# EAGLE board firefly-ice (EAGLE 6.4)
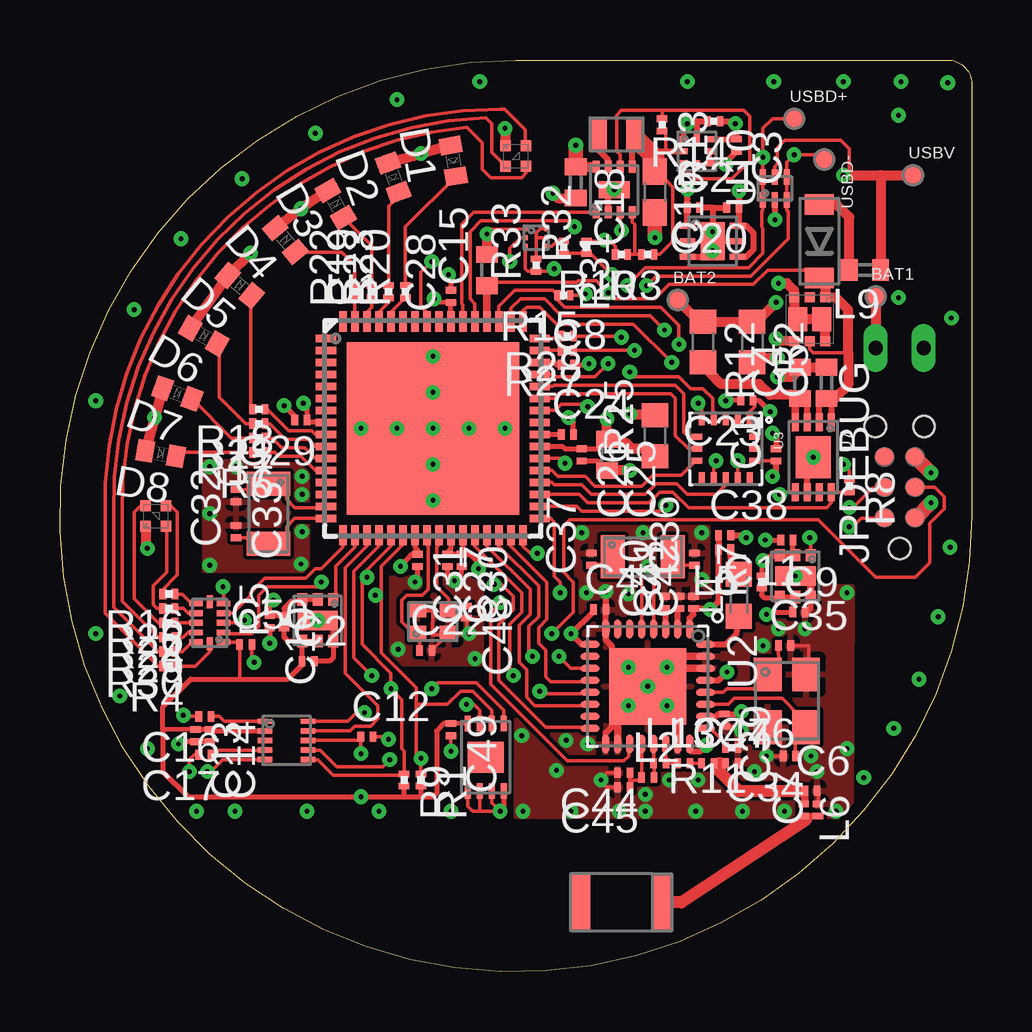
[diagram p6: board, top side]
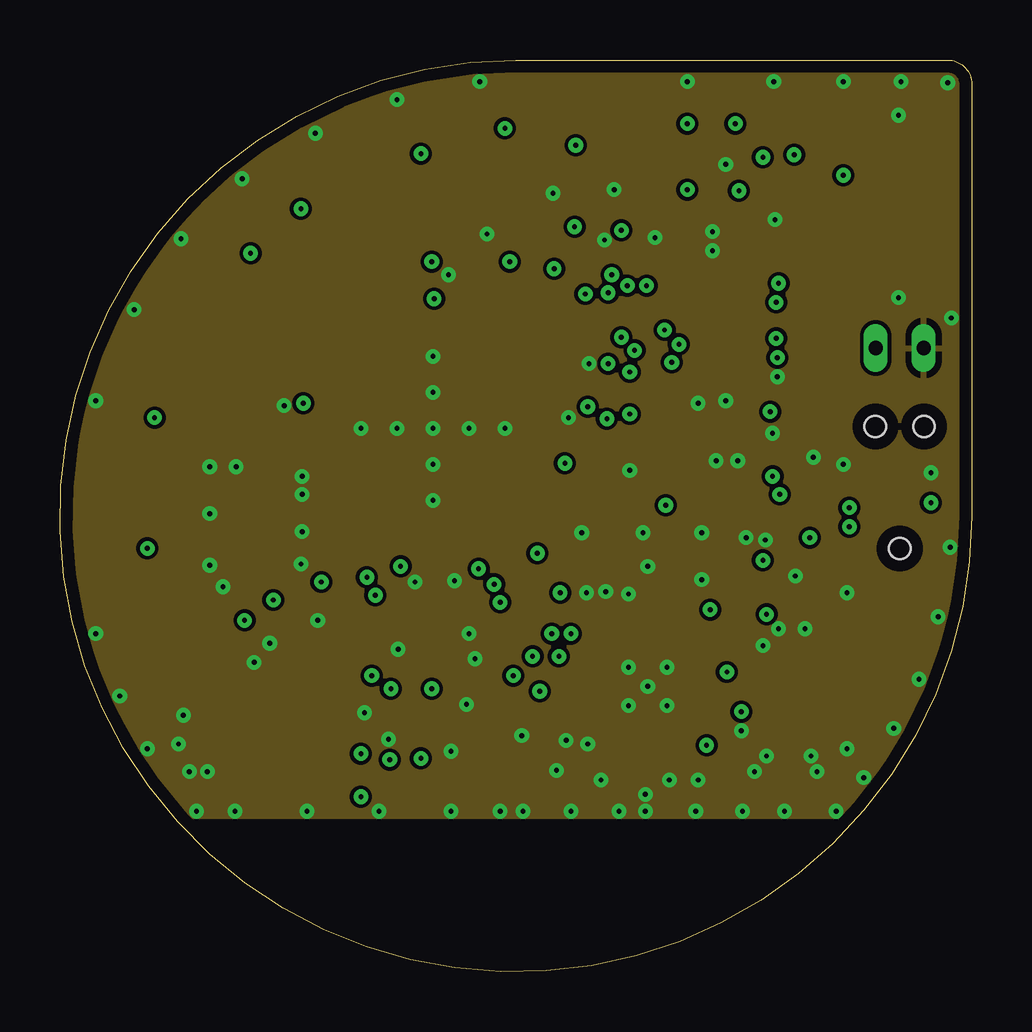
[diagram p7: board, inner layer Route2]
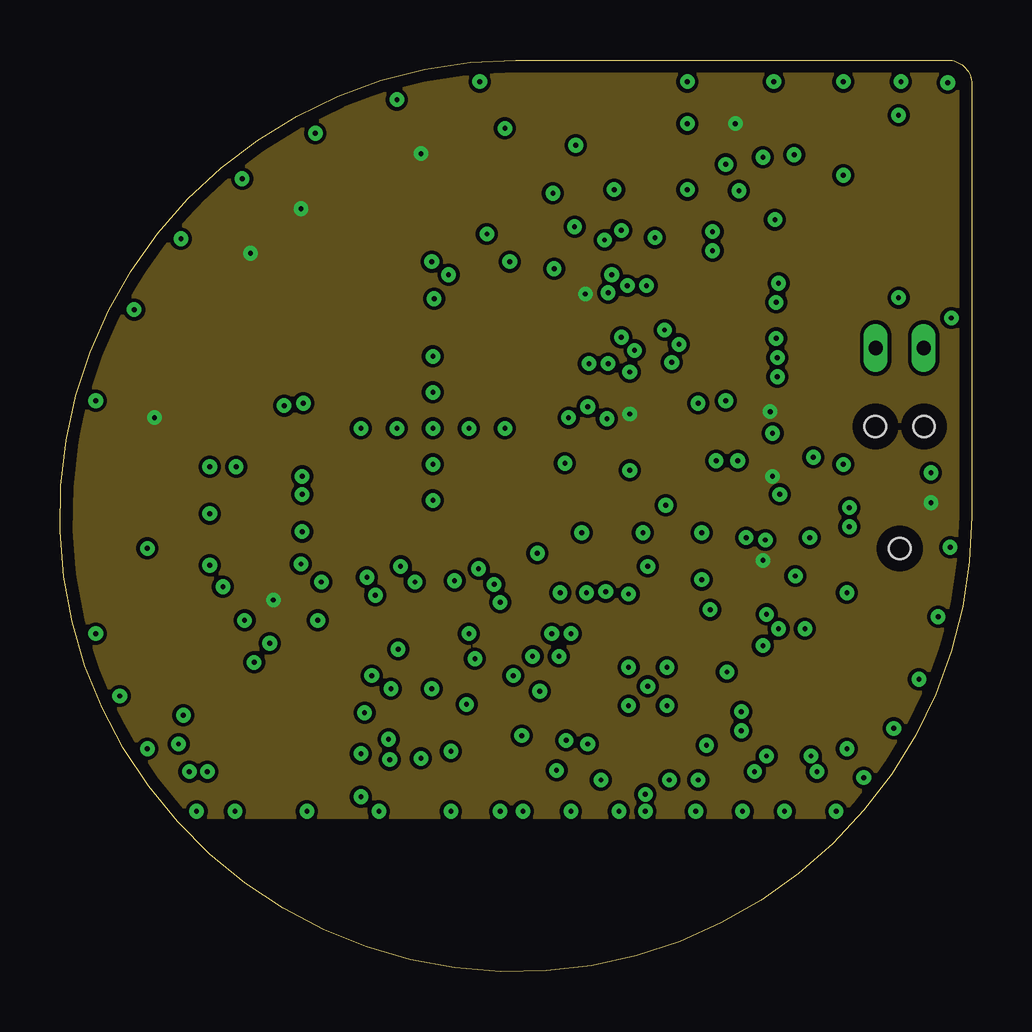
[diagram p8: board, inner layer Route15]
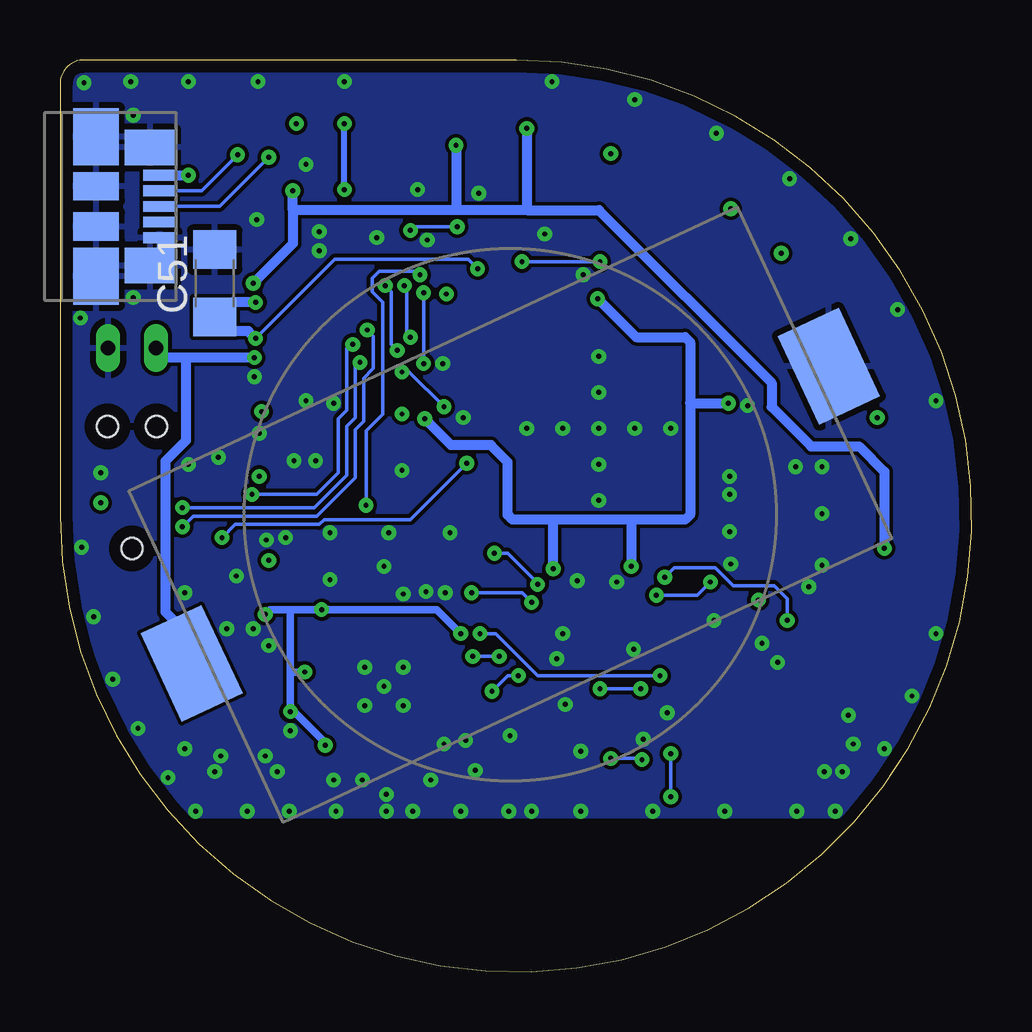
[diagram p9: board, bottom side, seen from below]

Size 37.99 x 37.99 mm. Coordinates in mm from the lower left corner, seen from the top.
Outline: 37.99,18.99 arc-270 18.99,37.99 36.99,37.99 arc-90 37.99,36.99 37.99,18.99
Copper layers (1+2*15+16): Top 0.0178mm / dielectric 12mil / Route2 0.0356mm / dielectric 28mil / Route15 0.0356mm / dielectric 12mil / Bottom 0.0178mm
Design rules "SSC-EAGLE-4Lyr_v1.0.0.3": minimum track width 6mil, minimum drill 8mil, track to track 6mil, track to pad 6mil, pad to pad 6mil, via to via 6mil, smd to smd 6mil, copper to edge 20mil, drill to drill 16mil, minimum pad ring 8mil, minimum via ring 8mil, stop-mask expansion 3mil, vias tented up to drill 0mil, thermal gap 10mil

## Footprints (pad centres in the part's own frame; a part is rotated, then mirrored left to right if it is on the bottom)
FR05_S1_N_0_110 = smd 0.8 x 2.4: FP -1.7,0; MP 1.7,0
SMTU2450N = smd 2.79 x 4.06: + -14.65,0; - 14.65,0
WP-28AWG = drill 0.6 long: 1 0,0
TARGET-PIN-1MM = smd 0.84 x 0.84: 1 0,0
C0201 = smd 0.28 x 0.43: 1 -0.255,0; 2 0.255,0
C0402 = smd 0.7 x 0.9: 1 -0.65,0; 2 0.65,0
C0603 = smd 1.1 x 1: 1 -0.85,0; 2 0.85,0
C1206 = smd 1.6 x 1.8: 1 -1.4,0; 2 1.4,0
SMLP34 = smd 0.45 x 0.45: 1 -0.425,0.425; 2 0.425,0.425; 3 0.425,-0.425; 4 -0.425,-0.425
D0402 = smd 0.7 x 0.9: A 0.65,0; C -0.65,0
SOD-123F = smd 0.85 x 1.2: A 1.525,0; C -1.525,0
MOLEX-47346 = smd 0.45 x 1.38: 1 -1.3,-0.69; 2 -0.65,-0.69; 3 0,-0.69; 4 0.65,-0.69; 5 1.3,-0.69 | smd 1.475 x 2.1: G1 -2.462,-1.1; G6 2.462,-1.1 | smd 2.375 x 1.9: G2 -2.913,-3.35; G5 2.913,-3.35 | smd 1.175 x 1.9: G3 -0.838,-3.35; G4 0.838,-3.35
TC2030-MCP-NL = smd 0.787 x 0.787: 1 1.27,-0.635; 2 1.27,0.635; 3 2.54,-0.635; 4 2.54,0.635 | smd 0.72 x 0.72: 5 3.81,-0.635; 6 3.81,0.635 | hole 0.889: 0,0; 5.08,-1.016; 5.08,1.016
L0201 = smd 0.28 x 0.43: 1 -0.255,0; 2 0.255,0
0603 = smd 1.05 x 1.08: 1 -0.875,0; 2 0.875,0
L0805 = smd 0.7 x 1.45: 1 -0.75,0; 2 0.75,0
L0402 = smd 0.7 x 0.9: 1 -0.65,0; 2 0.65,0
R0201 = smd 0.28 x 0.43: 1 -0.255,0; 2 0.255,0
R0603@1 = smd 1 x 1.1: 1 -0.85,0; 2 0.85,0
QFN64 = smd 0.85 x 0.3: 1 -4.45,3.75; 2 -4.45,3.25; 3 -4.45,2.75; 4 -4.45,2.25; 5 -4.45,1.75; 6 -4.45,1.25; 7 -4.45,0.75; 8 -4.45,0.25; 9 -4.45,-0.25; 10 -4.45,-0.75; 11 -4.45,-1.25; 12 -4.45,-1.75; 13 -4.45,-2.25; 14 -4.45,-2.75; 15 -4.45,-3.25; 16 -4.45,-3.75; 33 4.45,-3.75; 34 4.45,-3.25; 35 4.45,-2.75; 36 4.45,-2.25; 37 4.45,-1.75; 38 4.45,-1.25; 39 4.45,-0.75; 40 4.45,-0.25; 41 4.45,0.25; 42 4.45,0.75; 43 4.45,1.25; 44 4.45,1.75; 45 4.45,2.25; 46 4.45,2.75; 47 4.45,3.25; 48 4.45,3.75 | smd 0.3 x 0.85: 17 -3.75,-4.45; 18 -3.25,-4.45; 19 -2.75,-4.45; 20 -2.25,-4.45; 21 -1.75,-4.45; 22 -1.25,-4.45; 23 -0.75,-4.45; 24 -0.25,-4.45; 25 0.25,-4.45; 26 0.75,-4.45; 27 1.25,-4.45; 28 1.75,-4.45; 29 2.25,-4.45; 30 2.75,-4.45; 31 3.25,-4.45; 32 3.75,-4.45; 49 3.75,4.45; 50 3.25,4.45; 51 2.75,4.45; 52 2.25,4.45; 53 1.75,4.45; 54 1.25,4.45; 55 0.75,4.45; 56 0.25,4.45; 57 -0.25,4.45; 58 -0.75,4.45; 59 -1.25,4.45; 60 -1.75,4.45; 61 -2.25,4.45; 62 -2.75,4.45; 63 -3.25,4.45; 64 -3.75,4.45 | smd 7.2 x 7.2: 65 0,0
QFN-32 = smd 0.8 x 0.3: 1 -2.4,1.75; 2 -2.4,1.25; 3 -2.4,0.75; 4 -2.4,0.25; 5 -2.4,-0.25; 6 -2.4,-0.75; 7 -2.4,-1.25; 8 -2.4,-1.75; 17 2.4,-1.75; 18 2.4,-1.25; 19 2.4,-0.75; 20 2.4,-0.25; 21 2.4,0.25; 22 2.4,0.75; 23 2.4,1.25; 24 2.4,1.75 | smd 0.3 x 0.8: 9 -1.75,-2.4; 10 -1.25,-2.4; 11 -0.75,-2.4; 12 -0.25,-2.4; 13 0.25,-2.4; 14 0.75,-2.4; 15 1.25,-2.4; 16 1.75,-2.4; 25 1.75,2.4; 26 1.25,2.4; 27 0.75,2.4; 28 0.25,2.4; 29 -0.25,2.4; 30 -0.75,2.4; 31 -1.25,2.4; 32 -1.75,2.4 | smd 3.2 x 3.2: 33 0,0
LGA16_3X3 = smd 0.45 x 0.25: 1 -1.2,1; 2 -1.2,0.5; 3 -1.2,0; 4 -1.2,-0.5; 5 -1.2,-1; 9 1.2,-1; 10 1.2,-0.5; 11 1.2,0; 12 1.2,0.5; 13 1.2,1 | smd 0.25 x 0.45: 6 -0.5,-1.2; 7 0,-1.2; 8 0.5,-1.2; 14 0.5,1.2; 15 0,1.2; 16 -0.5,1.2
DFN10-2X2 = smd 0.6 x 0.225: 1 -0.9,0.8; 2 -0.9,0.4; 3 -0.9,0; 4 -0.9,-0.4; 5 -0.9,-0.8; 6 0.9,-0.8; 7 0.9,-0.4; 8 0.9,0; 9 0.9,0.4; 10 0.9,0.8
R-PX2QFN-N12 = smd 0.55 x 0.24: 1 -0.575,0.8; 2 -0.575,0.4; 3 -0.575,0; 4 -0.575,-0.4; 5 -0.575,-0.8; 7 0.575,-0.8; 8 0.575,-0.4; 9 0.575,0; 10 0.575,0.4; 11 0.575,0.8 | smd 0.25 x 0.55: 6 0,-0.875; 12 0,0.875
SOT963 = smd 0.2 x 0.2: 1 -0.45,0.36; 2 -0.45,0; 3 -0.45,-0.36; 4 0.45,-0.36; 5 0.45,0; 6 0.45,0.36
DFN8 = smd 0.75 x 0.3: 1 -1.45,0.75; 2 -1.45,0.25; 3 -1.45,-0.25; 4 -1.45,-0.75; 5 1.45,-0.75; 6 1.45,-0.25; 7 1.45,0.25; 8 1.45,0.75 | smd 1.75 x 1.45: PGND 0,0
MICROFET-2X2-6L = smd 0.52 x 0.42: 1 -0.865,0.65; 2 -0.865,0; 3 -0.865,-0.65; 4 0.865,-0.65; 5 0.865,0; 6 0.865,0.65 | smd 0.8 x 1.68: 7 0,0
UQFN6 = smd 0.65 x 0.25: 1 -0.475,0.5; 2 -0.475,0; 3 -0.475,-0.5; 4 0.475,-0.5; 5 0.475,0; 6 0.475,0.5
S-PWSON-N6 = smd 0.65 x 0.25: 1 -1.05,0.65; 2 -1.05,0; 3 -1.05,-0.65; 4 1.05,-0.65; 5 1.05,0; 6 1.05,0.65 | smd 1 x 1.6: TP 0,0
S-PWSON-N8 = smd 0.5 x 0.28: 1 -0.95,0.75; 2 -0.95,0.25; 3 -0.95,-0.25; 4 -0.95,-0.75; 5 0.95,-0.75; 6 0.95,-0.25; 7 0.95,0.25; 8 0.95,0.75 | smd 0.7 x 1.3: TP 0,0
SOT902-2 = smd 0.35 x 0.25: 1 -0.55,0.5; 2 -0.55,0; 3 -0.55,-0.5; 5 0.55,-0.5; 6 0.55,0; 7 0.55,0.5 | smd 0.25 x 0.35: 4 0,-0.55; 8 0,0.55
MO-229 = smd 0.42 x 0.42: 1 -0.915,0.65; 2 -0.915,0; 3 -0.915,-0.65; 4 0.915,-0.65; 5 0.915,0; 6 0.915,0.65 | smd 1 x 0.8: C 0,0.5; D 0,-0.5
UDFN-8 = smd 0.65 x 0.25: 1 -1.4,0.75; 2 -1.4,0.25; 3 -1.4,-0.25; 4 -1.4,-0.75; 5 1.4,-0.75; 6 1.4,-0.25; 7 1.4,0.25; 8 1.4,0.75 | smd 1.3 x 1.5: TP 0,0
9HT10 = smd 1 x 1.8: 1 -1.25,0; 2 1.25,0
TSX-3225 = smd 1.15 x 1.4: 1 -0.8,1.1; 2 -0.8,-1.1; 3 0.8,-1.1; 4 0.8,1.1
ABM11 = smd 0.65 x 0.75: 1 -0.5,0.65; 2 -0.5,-0.65; 3 0.5,-0.65; 4 0.5,0.65

## Placement (x,y rotation side)
A1  FR05_S1_N_0_110  [FR05_S1_N_0_110]  23.39,2.89 180 top
B1  BATTERYSMTU2450N  [SMTU2450N]  19.23,19.04 25 bottom
B+  TARGET-PINWP-28AWG  [WP-28AWG]  33.99,25.99 0 top
B-  TARGET-PINWP-28AWG  [WP-28AWG]  35.99,25.99 0 top
BAT1  TARGET-PIN  [TARGET-PIN-1MM]  33.99,28.14 0 top
BAT2  TARGET-PIN  [TARGET-PIN-1MM]  25.74,27.99 0 top
C1  100nF  [C0201]  29.84,21.54 90 top
C2  100nF  [C0201]  10.34,12.94 0 top
C3  1uF  [C0201]  28.19,34.44 270 top
C4  4.7uF  [C0402]  30.84,24.54 90 top
C5  4.7uF  [C0402]  31.94,24.54 90 top
C6  1.2pF  [C0201]  31.29,7.54 0 top
C7  DNS  [C0201]  31.59,6.74 90 top
C8  1uF  [C0201]  21.14,25.29 0 top
C9  100nF  [C0201]  30.79,14.99 0 top
C10  1uF  [C0201]  8.74,14.59 270 top
C11  1uF  [C0201]  30.29,17.99 180 top
C12  100nF  [C0201]  12.79,9.79 0 top
C13  100nF  [C0201]  5.64,9.84 270 top
C14  1uF  [C0201]  6.24,9.84 270 top
C15  4.7uF  [C0402]  17.79,29.24 90 top
C16  100nF  [C0201]  6.04,10.64 180 top
C17  100nF  [C0201]  6.04,9.04 180 top
C18  10uF  [C0402]  21.49,32.89 270 top
C19  22uF  [C0603]  24.79,32.49 270 top
C20  1uF  [C0201]  28.04,31.84 180 top
C21  1uF  [C0201]  26.39,31.84 0 top
C22  12pF  [C0201]  15.24,13.39 0 top
C23  100nF  [C0201]  28.62,23.81 180 top
C24  1uF  [C0201]  21.14,22.39 0 top
C25  10uF  [C0402]  22.79,21.54 270 top
C26  100nF  [C0201]  21.74,21.54 270 top
C27  100nF  [C0201]  16.14,17.14 270 top
C28  100nF  [C0201]  16.29,28.14 90 top
C29  100nF  [C0201]  10.04,22.99 180 top
C30  100nF  [C0201]  16.74,17.14 270 top
C31  100nF  [C0201]  14.89,17.14 270 top
C32  12pF  [C0201]  7.34,18.34 90 top
C33  12pF  [C0201]  7.34,19.84 270 top
C34  12pF  [C0201]  30.39,8.99 180 top
C35  12pF  [C0201]  30.19,13.59 0 top
C36  15pF  [C0201]  26.44,17.19 90 top
C37  15pF  [C0201]  22.14,17.19 90 top
C38  1uF  [C0201]  27.69,18.19 0 top
C39  1nF  [C0201]  27.69,10.49 270 top
C40  33nF  [C0201]  25.19,15.39 90 top
C41  100nF  [C0201]  25.79,15.39 90 top
C42  1uF  [C0201]  26.39,15.39 90 top
C43  100nF  [C0201]  22.49,15.09 0 top
C44  2.2nF  [C0201]  23.49,8.29 180 top
C45  DNS  [C0201]  23.49,7.69 180 top
C46  1.2pF  [C0201]  27.99,8.69 0 top
C47  1.8pF  [C0201]  26.99,8.69 0 top
C48  12pF  [C0201]  16.94,14.99 270 top
C49  100nF  [C0201]  16.29,10.09 270 top
C50  100nF  [C0201]  7.74,13.64 0 top
C51  100uF  [C1206]  31.54,28.69 90 bottom
D0  LED-RGB-CASMLP34  [SMLP34]  18.99,33.99 0 top
D1  LEDD0402  [D0402]  16.39,33.79 100 top
D2  LEDD0402  [D0402]  13.89,33.09 110 top
D3  LEDD0402  [D0402]  11.49,31.99 120 top
D4  LEDD0402  [D0402]  9.39,30.49 130 top
D5  LEDD0402  [D0402]  7.49,28.59 140 top
D6  LEDD0402  [D0402]  5.99,26.49 150 top
D7  LEDD0402  [D0402]  4.89,24.09 160 top
D8  LEDD0402  [D0402]  4.19,21.59 170 top
D9  LED-RGB-CASMLP34  [SMLP34]  3.99,18.99 90 top
D10  BAT54WSSOD-123F  [SOD-123F]  31.64,30.44 90 top
J1  USB-5PINMOLEX-47346  [MOLEX-47346]  33.14,31.89 270 bottom
JPDEBUG  TC2030-SWD  [TC2030-MCP-NL]  34.99,17.64 90 top
L1  8.2nH  [L0201]  24.99,8.69 0 top
L2  5.6nH  [L0201]  24.49,8.09 0 top
L3  3.9nH  [L0201]  25.99,8.69 0 top
L4  10uH  [0603]  28.29,15.69 90 top
L5  15nH  [L0201]  27.69,17.59 180 top
L6  7.5nH  [L0201]  30.99,6.74 270 top
L7  1uH  [L0805]  23.19,34.89 0 top
L9  Ferrite Bead  [L0402]  33.54,29.24 180 top
R1  4.7k  [R0201]  15.04,7.99 270 top
R2  0  [R0603@1]  28.84,26.24 270 top
R3  152.4k  [R0201]  24.49,29.89 180 top
R4  320  [R0201]  4.54,12.74 180 top
R5  0 (DNS)  [R0201]  9.34,14.59 90 top
R6  100  [R0201]  8.29,21.64 180 top
R7  0 (DNS)  [R0201]  29.24,16.24 90 top
R8  20k  [R0201]  32.89,20.24 270 top
R9  4.7k  [R0201]  14.34,7.99 270 top
R10  39.2k  [R0201]  23.39,29.89 180 top
R11  22k  [R0201]  27.99,9.34 180 top
R12  0  [R0603@1]  26.79,26.24 270 top
R13  100k  [R0201]  25.09,35.29 270 top
R14  0 (DNS)  [R0201]  27.24,35.44 180 top
R15  100k  [R0201]  20.99,28.19 180 top
R16  100  [R0201]  4.54,15.74 180 top
R17  100  [R0201]  8.29,22.24 180 top
R18  100  [R0201]  8.29,23.44 180 top
R19  100  [R0201]  12.99,28.34 90 top
R20  100  [R0201]  14.39,28.34 90 top
R21  100  [R0201]  8.29,22.84 180 top
R22  100  [R0201]  12.29,28.34 90 top
R23  100  [R0201]  13.69,28.34 90 top
R24  320  [R0201]  4.54,14.54 180 top
R25  0  [R0603@1]  24.79,22.34 90 top
R26  100  [R0201]  4.54,15.14 180 top
R27  15  [R0201]  21.14,25.89 180 top
R28  15  [R0201]  21.14,26.49 180 top
R29  100  [R0201]  4.54,13.94 180 top
R30  100  [R0201]  4.54,13.34 180 top
R31  100k  [R0201]  20.99,30.19 270 top
R32  100k  [R0201]  21.94,30.19 90 top
R33  100k  [R0201]  19.84,29.44 90 top
U1  EFM32LG330F256  [QFN64]  15.54,22.64 0 top
U2  NRF8001  [QFN-32]  24.49,11.89 270 top
U3  LIS3DH  [LGA16_3X3]  27.74,21.79 270 top
U4  MAG3110  [DFN10-2X2]  9.44,9.64 0 top
U5  TCA6507  [R-PX2QFN-N12]  6.24,14.54 180 top
U6  MOSFET-N+PSOT963  [SOT963]  19.84,30.59 0 top
U7  MCP73832DFN8  [DFN8]  31.39,21.44 270 top
U8  FPF100X  [MICROFET-2X2-6L]  30.64,16.49 270 top
U9  FPF100X  [MICROFET-2X2-6L]  10.74,14.64 270 top
U10  USB-ESD  [UQFN6]  29.79,32.64 90 top
U11  TPS782XX  [S-PWSON-N6]  27.19,30.44 0 top
U12  TPS6208X  [S-PWSON-N8]  23.09,32.59 90 top
U13  NX3L1T53  [SOT902-2]  26.54,34.19 0 top
U14  FDFMA2P029Z  [MO-229]  31.24,27.19 270 top
U15  MEMORY-I2CUDFN-8  [UDFN-8]  17.74,8.94 90 top
USBD+  TARGET-PIN  [TARGET-PIN-1MM]  30.59,35.54 0 top
USBD-  TARGET-PIN  [TARGET-PIN-1MM]  31.84,33.84 270 top
USBV  TARGET-PIN  [TARGET-PIN-1MM]  35.54,33.19 0 top
X1  32kHz  [9HT10]  8.69,19.09 270 top
X2  16MHz  [TSX-3225]  30.29,11.29 0 top
X3  32kHz  [9HT10]  24.29,17.29 0 top
X4  48MHz  [ABM11]  15.54,14.59 90 top

## Tracks (layer width: path | path; a pad name or v marks a point on that pad's centre or on a via)
ACC_CSN
  Top 0.152: U3.8 26.49,21.29 25.89,20.69 24.69,20.69 24.24,20.24 22.29,20.24 21.89,20.64 20.74,20.64 20.49,20.89 U1.37
ACC_INT
  Top 0.152: U3.11 27.74,20.29 27.34,19.89 26.14,19.89 25.69,20.34 24.84,20.34 24.39,19.89 22.14,19.89 21.74,20.29 20.59,20.29 20.49,20.39 U1.36
AUX_PWR
  Top 0.152: U9.1 11.39,15.59 | 11.34,15.64 U9.1 | U1.18 12.29,17.69 11.49,16.89 11.49,15.59 U9.1
AUX_V+  (via drill 0.2)
  Top 0.152: C14.1 6.29,10.09 6.34,10.04 | v12.54,9.09 12.54,9.24 C12.1 12.44,9.64 U4.8 | U5.1 7.44,13.74 C50.1 7.49,12.19
  Top 0.2: U9.4 C2.1 10.09,12.79 9.49,12.19 7.49,12.19 5.44,12.19 4.29,11.04 4.29,10.09 | U9.5 U9.4 | U9.4 9.5,13.77 9.34,13.94 R5.1 | C14.1 C13.1 4.29,10.09 | 6.34,10.04 U4.2 | 4.29,10.09 4.29,8.34 5.34,7.29 v12.54,7.29 14.34,7.29 | 14.34,7.29 R9.2 | R1.2 15.03,7.48 15.04,7.29 | 14.34,7.29 15.04,7.29 | U15.8 C49.1 15.99,10.34 15.69,10.04 15.69,7.44 15.54,7.29 15.04,7.29
  Bottom 0.152: v12.54,7.29 v12.54,9.09
BAT_V  (via drill 0.2)
  Top 0.152: 28.34,27.19 R2.1 | v20.59,29.29 20.49,29.19 R33.1 19.49,29.18 19.39,29.29 U6.3
  Top 0.406: U14.4 29.99,26.29 29.89,26.34 v29.84,26.39 | v29.84,27.89 29.04,27.09 R2.1 R12.1 26.54,27.19 BAT2.1
  Bottom 0.152: v20.59,29.29 20.99,29.69 26.54,29.69 v29.84,26.39
  Bottom 0.406: v29.84,27.89 30.84,27.89 C51.1 30.94,26.84 30.79,26.69 30.14,26.69 v29.84,26.39
BAT_V/2  (via drill 0.2)
  Top 0.152: v22.99,29.04 22.09,29.94 R32.1 21.64,29.94 21.34,29.94 R31.2 | U1.34 21.54,19.39 21.74,19.19 24.99,19.19 v25.24,19.44
  Bottom 0.152: v22.99,29.04 23.14,29.19 24.69,29.19 24.99,28.89 24.99,28.34 24.54,27.89 24.54,23.24 25.24,22.54 v25.24,19.44
BAT_V/2EN  (via drill 0.2)
  Top 0.152: U1.57 15.29,27.49 15.04,27.74 15.04,29.14 v15.49,29.59 | U6.2 19.19,30.59 18.74,30.14 v18.74,29.59
  Bottom 0.152: v15.49,29.59 v18.74,29.59
CHG_RATE
  Top 0.152: U1.35 21.64,19.89 21.99,19.54 24.54,19.54 24.99,19.99 25.54,19.99 26.19,19.34 31.94,19.34 32.14,19.54 U7.8 32.64,19.98 R8.2
CHG_STAT  (via drill 0.2)
  Top 0.152: v25.79,26.14 25.79,26.94 25.04,27.69 21.04,27.69 20.74,27.99 R15.2 20.54,28.39 18.94,28.39 18.29,27.74 U1.51 | v29.99,19.89 30.09,19.99 U7.5
  Bottom 0.152: v25.79,26.14 26.04,25.99 26.04,23.39 26.39,23.04 26.39,20.79 27.29,19.89 v29.99,19.89
D0
  Top 0.152: R30.2 4.09,13.34 2.24,15.19 2.24,19.04 arc-90 17.74,35.59 17.99,35.34 17.99,34.14 D0.4
GND  (via drill 0.2, 0.2 pad 0.2)
  Top 0.152: C34.2 v29.44,8.99 29.44,9.99 X2.2 | X2.4 31.19,12.49 31.19,13.59 C35.2 | v28.39,10.04 28.29,9.79 28.29,9.39 R11.1 | C39.2 27.79,10.19 | 25.74,10.64 v25.29,11.09 U2.33 | 23.24,10.64 v23.69,11.09 U2.33 | 25.24,12.64 U2.33 | 25.74,13.14 v25.29,12.69 U2.33 | C45.2 22.79,7.69 v22.54,7.99 22.79,8.29 C44.2 | C7.2 31.59,7.49 C6.2 | 11.39,14.59 11.34,14.64 U9.7 | 31.29,16.44 31.24,16.49 U8.7 | U3.12 v28.24,21.29 | U3.10 27.24,21.19 v27.34,21.29 | U3.5 26.74,23.54 v26.59,23.69 | C16.2 5.19,10.64 v5.14,10.69 | C13.2 5.49,9.59 | U4.5 6.79,8.84 6.29,8.34 v6.14,8.34 | C17.2 5.59,9.04 5.39,8.84 v5.39,8.34 | U4.10 11.99,10.44 12.34,10.79 v12.69,10.79 | C12.2 13.54,9.79 v13.69,9.69 | 32.04,25.19 C5.2 | 31.14,21.19 U7.PGND | U11.TP v27.19,30.04 26.94,29.79 | 22.84,32.44 U12.TP 23.49,32.59 | U13.4 27.04,33.64 U13.5 U13.6 | U7.6 | C48.2 16.94,14.19 v17.04,14.09 X4.2 | X4.4 15.09,15.04 15.54,15.04 15.54,14.04 16.09,14.04 X4.2 | C22.2 X4.2 | U15.7 17.49,10.89 17.24,11.14 v16.94,11.14 | U15.1 16.99,6.89 17.19,6.69 17.54,6.69 | 17.54,6.69 v18.34,6.69 17.99,7.04 U15.3 | U15.2 17.49,6.74 17.54,6.69 | C49.2 v16.29,9.19 | C50.2 7.99,13.69 7.99,12.99 v8.09,12.89 | U5.5 6.81,15.96 v6.79,16.04 | R8.1 32.89,20.89 v32.64,21.14 | R10.2 23.13,29.93 23.14,29.94 23.14,30.24 22.89,30.49 v22.69,30.49 22.64,30.44 R32.2 | U6.1 17.99,30.94 v17.79,30.74
  Top 0.2: v27.74,23.79 27.79,23.84 28.25,23.84 C23.2 | C24.2 21.39,22.89 v21.19,23.09 | 11.39,14.59 U9.6 11.39,13.09 11.24,12.94 C2.2 | C10.2 v8.74,13.69 | U8.6 31.29,15.14 31.14,14.99 C9.2 | v29.39,17.99 C11.2 | C14.2 C13.2 | 5.49,9.59 5.04,9.59 v4.94,9.49 | C26.2 22.39,21.29 C25.2 | C8.2 21.99,25.29 v22.04,25.34 | C31.2 14.89,16.34 v14.79,16.24 | C30.2 16.69,16.54 v16.44,16.29 16.14,16.59 C27.2 | C29.2 9.79,23.14 v9.34,23.59 | v16.19,29.04 16.29,28.94 C28.2 | U15.4 18.49,6.84 v18.34,6.69
  Top 0.254: v29.69,22.44 29.84,22.29 C1.2 | v22.74,15.84 C43.2 U2.8 22.74,13.84 22.99,13.59 22.99,13.49 U2.33 23.09,10.39 22.99,10.29 22.99,10.19 22.74,9.94 U2.17 | v28.39,10.04 28.29,10.19 27.79,10.19 | C38.2 28.49,18.19 v28.59,18.09 | U7.6 31.14,21.19 | U11.5 U11.TP | U11.3 26.94,29.79 | 27.19,31.84 C20.2 | 27.19,31.84 C21.2 | U13.5 27.69,33.69 v27.74,33.64 27.74,33.74 C3.2 | U12.2 22.84,32.44 | 27.19,31.84 v27.19,30.84 | U10.2 v29.79,31.34
  Top 0.305: U2.23 25.74,10.64 | U2.18 23.24,10.64 | U2.30 25.24,12.64 | U2.31 25.74,13.14 | U8.6 31.29,16.44
  Top 0.406: v23.74,20.89 C25.2 | v20.54,32.44 20.74,32.24 C18.2 | v17.79,30.74 C15.2 | C5.2 C4.2 30.54,24.79 v29.89,24.79
  Top 0.61: JPDEBUG.5 35.84,21.24 v36.29,20.79 | C19.2 v24.79,30.59
  other vias: 10.74,14.64 26.74,16.34 30.64,16.49 21.74,18.29 28.94,8.34 10.09,19.89 10.09,18.34 6.24,21.04 6.24,19.09 6.24,16.94 19.24,9.84 19.29,6.69 21.29,6.69 23.29,6.69 24.39,6.69 24.39,7.39 25.39,7.99 26.59,7.99 26.49,6.69 28.44,6.69 30.19,6.69 31.54,8.34 31.29,8.99 32.79,9.29 34.74,10.14 29.29,13.59 29.94,14.29 31.04,14.29 32.79,15.79 24.49,11.89 23.69,12.69 5.69,6.69 7.29,6.69 10.29,6.69 13.29,6.69 16.29,6.69 3.64,9.29 2.49,11.49 1.49,14.09 7.59,33.04 5.04,30.54 1.49,23.79 3.09,27.59 10.64,34.94 14.04,36.34 17.49,37.09 26.14,37.09 37.09,17.69 36.59,14.79 35.79,12.19 33.49,8.09 31.39,21.44 23.09,32.59 29.74,37.09 15.54,22.64 15.54,24.14 15.54,25.64 15.54,21.14 15.54,19.64 17.04,22.64 12.54,22.64 14.04,22.64 18.54,22.64 21.09,9.64 21.99,9.49 14.09,13.44 17.29,13.04 37.14,27.24 26.74,18.29 23.69,15.74 24.29,18.29 24.49,16.89 21.94,15.79 10.09,20.64 10.04,16.99 20.69,8.39 36.99,37.04 7.34,21.04 32.64,37.09 35.04,37.09 34.94,28.09 34.94,35.69 32.34,6.69
  pour Top: 5.99,16.69 5.99,21.29 10.34,21.29 10.34,16.69
  pour Top: 18.99,6.49 32.99,6.49 33.04,16.04 19.04,16.04
  pour Top: 13.79,16.44 13.79,12.79 17.59,12.79 17.59,16.44
  pour Top: 27.04,18.54 21.49,18.54 21.49,14.94 27.04,14.94
  pour Route2: 37.39,18.99 37.39,36.99 arc90 36.99,37.39 18.99,37.39 arc133 5.49,6.49 32.49,6.49 arc43
  pour Bottom: 37.39,18.99 37.39,36.99 arc90 36.99,37.39 18.99,37.39 arc133 5.49,6.49 32.49,6.49 arc43
I2C1_SCL  (via drill 0.2)
  Top 0.152: v13.74,8.84 13.44,8.54 11.54,8.54 10.84,9.24 U4.7 | R1.1 v15.04,8.89 14.84,9.09 14.84,11.14 | U1.22 14.29,17.79 13.39,16.89 13.39,15.69 | 14.84,11.14 14.84,11.84 13.39,13.29 13.39,15.69 | U15.6 17.99,10.89 17.19,11.69 16.69,11.69 16.14,11.14 14.84,11.14 | U5.2 6.99,14.14 7.04,14.09 7.99,14.09 8.29,14.39 8.29,15.69 8.64,16.04 10.69,16.04 v10.89,16.24 | v13.14,15.69 13.39,15.69
  Bottom 0.152: v15.04,8.89 13.79,8.89 v13.74,8.84 | v10.89,16.24 11.44,15.69 v13.14,15.69
I2C1_SDA  (via drill 0.2)
  Top 0.152: U4.6 10.74,8.84 11.39,8.19 14.29,8.19 R9.1 14.34,9.19 14.24,9.29 14.24,11.34 v13.79,11.79 13.79,12.44 12.59,13.64 12.59,16.54 | U1.21 13.79,17.74 12.59,16.54 | U15.5 18.49,10.89 17.34,12.04 15.74,12.04 v15.49,11.79 | U5.3 7.59,14.54 v7.69,14.64 | v12.79,16.44 12.59,16.54
  Bottom 0.152: v7.69,14.64 7.69,15.54 8.24,16.09 9.94,16.09 10.69,16.84 12.39,16.84 v12.79,16.44 | v15.49,11.79 v13.79,11.79
LED1
  Top 0.152: U1.60 13.79,27.49 R20.1
LED2
  Top 0.152: U1.61 13.29,27.49 13.69,27.89 R23.1
LED3
  Top 0.152: U1.62 12.79,27.49 12.99,27.69 R19.1
LED4
  Top 0.152: U1.63 R22.1
LED5
  Top 0.152: R18.1 8.64,23.44 9.54,22.54 10.49,22.54 10.64,22.39 U1.9
LED6
  Top 0.152: R21.1 8.74,22.84 9.39,22.19 10.34,22.19 10.64,21.89 U1.10
LED7
  Top 0.152: R17.1 8.84,22.24 9.24,21.84 10.19,21.84 10.64,21.39 U1.11
LED8
  Top 0.152: R6.1 8.94,21.64 9.09,21.49 10.04,21.49 10.64,20.89 U1.12
LED_EN
  Top 0.152: U5.4 7.19,14.94 7.94,15.69 7.94,15.79 8.54,16.39 10.24,16.39 10.64,16.79 10.89,16.79 11.79,17.69 U1.17
MAG_INT
  Top 0.152: U4.9 12.09,10.04 12.29,10.24 12.94,10.24 13.24,10.54 13.24,11.09 11.89,12.44 11.89,16.84 12.79,17.74 U1.19
N$1
  Top 0.152: L6.2
  Top 0.2: L6.2 31.09,6.34
  Top 0.28: C7.1 L6.2
  Top 0.5: A1.FP 25.89,2.89 31.09,6.34
N$2  (via drill 0.2)
  Top 0.152: U1.20 13.29,17.74 12.24,16.69 12.24,13.09 v12.99,12.34 | v20.49,14.09 21.39,14.99 21.39,16.24 20.99,16.64 20.99,18.59 21.24,18.84 31.59,18.84 33.99,16.44 35.64,16.44 36.24,17.04 36.24,18.69 36.84,19.29 36.84,19.79 36.45,20.18 JPDEBUG.3
  Bottom 0.152: v12.99,12.34 18.09,12.34 19.84,14.09 v20.49,14.09
N$3
  Top 0.254: U7.3 31.14,23.59 C4.1
  Top 0.305: U7.4 30.64,23.69 C4.1
  Top 0.406: C4.1 30.64,23.89 30.49,24.04 29.59,24.04 29.14,24.49 27.54,24.49 27.09,24.94 27.09,25.39 R12.2
N$4
  Top 0.152: R3.2 R10.1 23.94,29.89 23.94,31.14 23.84,31.24 U12.4
N$5
  Top 0.152: U5.9 R24.1
N$6
  Top 0.152: U5.10 5.34,14.14 5.14,13.94 R29.1
N$7
  Top 0.2: U1.46 20.59,25.39 20.69,25.29 C8.1
N$8  (via drill 0.2)
  Top 0.152: 29.95,15.59 U8.4 | 28.24,10.74 v28.39,10.84 | U2.24 26.24,9.24 26.29,9.19 | C42.1 26.59,15.14 | 27.44,17.64 L5.2 | C43.1 22.19,14.99
  Top 0.2: R7.1 29.24,15.69 29.34,15.59 29.95,15.59 | U8.4 U8.5 30.54,15.49 C9.1 29.54,14.99 v29.44,14.89
  Top 0.254: U2.26 27.29,10.64 27.39,10.69 27.44,10.74 C39.1 28.24,10.74 | U2.29 27.44,12.14 v27.79,12.49 | 26.29,9.19 26.69,9.19 v26.94,9.44 | 26.59,15.14 26.99,15.14 v27.09,15.09 27.44,15.44 27.44,17.29 27.43,17.28 L5.2 | C38.1 27.44,17.64 | 22.19,14.99 v21.29,14.09 21.74,13.64 U2.9 | U2.1 26.24,14.74 26.39,14.89 C42.1
  Bottom 0.305: 28.39,12.49 v28.39,10.84 28.24,10.84 26.94,9.54 v26.94,9.44 | v27.79,12.49 28.39,12.49 | 28.39,15.09 v27.09,15.09 22.29,15.09 v21.29,14.09 | 28.39,15.09 29.24,15.09 v29.44,14.89 | 28.39,12.49 28.39,15.09
N$9
  Top 0.152: 4.92,21.39 D8.C 4.99,21.64 R6.2
N$10
  Top 0.152: 5.69,23.69 5.68,23.69 D7.C 7.14,22.24 R17.2
N$11
  Top 0.152: R21.2 7.74,22.84 6.64,23.94 6.64,26.08 D6.C
N$12
  Top 0.152: D5.C 7.94,28.12 7.94,23.64 R18.2
N$13
  Top 0.152: 9.89,29.81 D4.C 11.74,29.99 12.29,29.44 R22.2
N$14
  Top 0.152: 11.79,31.4 D3.C 12.99,30.25 R19.2
N$15
  Top 0.152: 14.09,32.46 D2.C 14.14,32.45 14.14,32.34 13.69,31.89 R23.2
N$16
  Top 0.152: C35.1 29.94,12.84 X2.1 29.19,12.09 29.19,11.89 29.09,11.79 27.79,11.79 27.64,11.64 U2.28
N$17
  Top 0.152: C34.1 30.64,9.74 X2.3 30.79,10.49 30.79,10.69 30.09,11.39 28.09,11.39 27.84,11.14 U2.27
N$18
  Top 0.152: C37.1 22.39,16.99 23.14,16.99 23.29,17.44 | U2.5 24.24,16.34 24.09,16.49 23.49,16.49 X3.1 23.29,17.44 | 23.19,16.99 23.29,17.44
N$19
  Top 0.152: 16.49,33.14 D1.C 14.39,31.04 R20.2
N$20
  Top 0.152: U5.12 6.24,13.34 5.64,12.74 R4.1
N$21
  Top 0.152: U1.25 15.79,17.79 15.69,17.69 15.69,16.04 16.19,15.54 X4.3 16.29,15.24 C48.1
N$22  (via drill 0.2)
  Top 0.152: v23.39,26.44 23.34,26.49 R28.1 | USBD+.1 29.69,35.54 29.29,35.14 v29.29,33.94 U10.6 U10.1 29.29,31.74 29.24,31.69 29.24,31.04 29.29,30.99 29.29,29.94 28.69,29.34 24.39,29.34 v23.64,28.59
  Bottom 0.152: J1.3 31.34,31.89 v29.29,33.94 | v23.64,28.59 23.54,28.49 23.54,26.64 v23.39,26.44
N$23
  Top 0.2: U1.40 C24.1
N$24
  Top 0.152: 22.39,34.84 L7.1
  Top 0.254: U12.7 22.84,33.84 22.39,34.29 22.39,34.84
N$25
  Top 0.152: C33.1 8.29,20.09 8.39,19.99 X1.1 9.41,19.96 9.44,19.69 9.79,19.34 11.09,19.34 U1.15
N$26
  Top 0.152: U12.6 23.34,34.04 23.19,34.19 23.19,35.69 23.39,35.89 25.09,35.89 | 25.09,35.89 28.49,35.89 28.74,35.64 28.74,33.79 27.99,33.04 26.44,33.04 25.99,33.49 U13.3 | R13.1 25.09,35.89
N$27
  Top 0.152: C36.1 26.54,16.94 25.79,16.94 X3.2 25.09,16.49 24.89,16.49 24.74,16.34 U2.4
N$28
  Top 0.152: 23.84,34.64 23.89,34.69 L7.2 | C19.1 24.84,33.24 25.04,33.24 25.54,32.69 25.54,30.44 24.99,29.89 R3.1 | R13.2 25.24,34.89 25.24,34.19
  Top 0.254: U12.5 23.84,34.64 | 24.84,33.24 24.84,34.19 25.24,34.19 U13.2
  Top 0.406: 24.04,34.69 L7.2
  Top 0.813: C19.1 24.79,33.94 24.04,34.69
N$29  (via drill 0.2)
  Top 0.152: 26.14,31.89 C21.1
  Top 0.254: U11.1 26.14,31.89 | C21.1 26.14,32.19 v26.14,32.59 | 26.54,35.44 26.29,35.44 v26.14,35.34 25.99,35.24 U13.1 | 26.54,35.44 U13.8 | 26.54,35.44 R14.2
  Bottom 0.254: v26.14,32.59 v26.14,35.34
N$30
  Top 0.406: L9.2 32.89,31.44 32.36,31.96 D10.A
N$31  (via drill 0.2)
  Top 0.152: v23.94,25.89 R27.1 | USBD-.1 31.64,34.04 v30.59,34.04 30.29,33.74 U10.4 U10.3 30.29,31.74 30.34,31.69 30.34,30.54 28.79,28.99 24.84,28.99 v24.44,28.59
  Bottom 0.152: J1.2 32.09,32.54 v30.59,34.04 | v24.44,28.59 24.19,28.34 24.19,26.14 v23.94,25.89
N$32
  Top 0.152: U4.1 6.84,10.44 6.64,10.64 C16.1
N$33
  Top 0.152: C17.1 6.34,9.04 6.39,9.09 6.49,9.09 6.64,9.24 U4.4
N$34
  Top 0.152: C22.1 14.99,13.89 X4.1 14.69,14.29 14.54,14.29 14.24,14.59 14.24,15.49 14.44,15.69 15.09,15.69 15.34,15.94 15.34,17.74 15.29,17.79 U1.24
N$35  (via drill 0.2)
  Top 0.152: U1.50 18.79,27.64 19.19,28.04 20.19,28.04 20.89,27.34 24.59,27.34 v25.19,26.74 | v32.89,18.54 33.04,18.54 33.39,18.89 33.94,18.89 JPDEBUG.2
  Bottom 0.152: v25.19,26.74 24.94,26.49 24.94,25.14 25.34,24.74 25.34,22.94 25.69,22.59 25.69,20.59 27.29,18.99 32.44,18.99 v32.89,18.54
N$36
  Top 0.152: U2.25 27.09,10.14 27.69,9.54 27.69,9.39 R11.2
N$37
  Top 0.152: U5.7 5.49,15.34 5.09,15.74 R16.1
N$38  (via drill 0.2)
  Top 0.152: U10.5 29.79,33.54 29.89,33.64 29.89,34.34 30.19,34.64 32.54,34.64 32.89,34.29 32.89,33.39 v32.64,33.19
  Top 0.406: v32.64,33.19 34.19,33.19 | 34.19,33.19 L9.1 | 34.19,33.19 USBV.1
  Bottom 0.406: J1.1 v32.64,33.19
N$39  (via drill 0.2)
  Top 0.152: U1.49 19.29,27.54 19.44,27.69 19.99,27.69 20.69,26.99 23.89,26.99 v25.49,25.39 | v32.89,19.34 33.04,19.34 33.84,20.14 34.29,20.14 34.34,20.19 JPDEBUG.4
  Bottom 0.152: v25.49,25.39 25.69,25.24 25.69,23.09 26.04,22.74 26.04,20.69 27.39,19.34 v32.89,19.34
N$40
  Top 0.152: C32.1 8.19,18.09 X1.2 9.44,17.84 9.44,18.54 9.79,18.89 U1.16
N$41
  Top 0.152: U5.8 5.34,14.94 5.14,15.14 R26.1
N$42  (via drill 0.2)
  Top 0.152: 16.79,17.39 C30.1 | 16.14,17.49 C27.1
  Top 0.2: U1.23 14.79,17.69 14.89,17.59 C31.1 14.64,17.39 v14.19,16.89 | U1.27 16.79,17.39 | C27.1 C30.1 17.09,17.39 17.34,17.14 v17.44,16.79 | C25.1 22.39,21.79 C26.1 21.04,21.79 20.94,21.89 U1.39 | U1.8 10.39,22.89 C29.1 10.29,23.54 v10.14,23.69 | U1.26 16.29,17.64 16.14,17.49 | U1.55 C28.1 15.74,27.89 v15.59,28.04
  Top 0.406: v22.79,23.04 C25.1 22.89,22.19 23.04,22.04 23.59,22.04 23.84,21.79 24.44,21.79 24.54,21.69 R25.1
  Bottom 0.406: v15.59,28.04 13.99,26.44 11.94,26.44 11.74,26.24 11.74,23.69 | 11.74,23.69 11.74,19.04 11.94,18.84 14.19,18.84 | 14.19,18.84 17.44,18.84 | 17.44,18.84 19.14,18.84 19.34,19.04 19.34,21.24 20.04,21.94 21.69,21.94 v22.79,23.04 | 11.74,23.69 v10.14,23.69 | 14.19,18.84 v14.19,16.89 | v17.44,16.79 17.44,18.84
N$43
  Top 0.152: 25.24,14.99 C40.1
  Top 0.254: U2.3 25.24,14.99
N$44
  Top 0.152: U5.11 5.49,13.74 5.09,13.34 R30.1
N$45
  Top 0.152: R33.2 19.84,30.59 | 19.84,30.59 19.84,30.79 19.99,30.94 U6.6 | U6.5 19.84,30.59
N$46
  Top 0.152: R29.2 4.09,13.94 2.59,15.44 2.59,19.04 arc-86 16.94,35.19 17.59,34.54 17.59,33.44 17.94,33.09 19.24,33.09 19.41,33.26 D0.3
N$47
  Top 0.152: R26.2 4.04,15.14 3.89,15.29 3.89,16.09 4.44,16.64 4.44,18.44 D9.4
N$48
  Top 0.152: R16.2 4.29,15.79 4.34,15.84 4.34,15.99 4.79,16.44 4.89,16.54 4.89,19.14 4.63,19.39 4.58,19.39 D9.3
N$49
  Top 0.152: 25.74,15.09 C41.1
  Top 0.254: U2.2 25.74,15.09
N$50
  Top 0.152: L3.2 C47.1
N$51
  Top 0.152: C47.2 27.49,8.69 C46.1 | 31.04,7.06 L6.1
  Top 0.25: 30.84,7.54 C6.1
  Top 0.305: C6.1 31.04,7.06
  Top 0.5: 30.84,7.54 28.29,7.54 27.49,8.34 27.49,8.69
N$52
  Top 0.152: U2.20 24.24,8.11 L2.1 24.09,7.99 23.74,7.99 C44.1 C45.1
N$53
  Top 0.152: U2.21 24.74,8.81 L1.1 24.76,8.54 L2.2
N$54
  Top 0.152: U2.22 25.24,8.76 L1.2 L3.1
N$55
  Top 0.254: U2.32 27.74,13.64 28.19,14.09 L4.1
N$56
  Top 0.254: L4.2 28.19,16.59 27.96,16.81 L5.1
N$57
  Top 0.152: R4.2 4.09,12.74 1.89,14.94 1.89,18.79 arc-93 18.34,35.94 18.54,35.94 19.39,35.09 19.39,34.44 D0.2
N$58
  Top 0.152: R24.2 4.09,14.54 3.09,15.54 3.09,19.14 3.34,19.39 D9.2
N$60
  Top 0.152: U6.4 20.49,30.24 20.69,30.44 R31.1
NRF_PWR  (via drill 0.2)
  Top 0.152: U8.1 31.29,18.04 v31.24,18.09 | U1.38 20.84,21.39 v21.04,21.19
  Bottom 0.152: v21.04,21.19 23.39,18.84 26.99,18.84 27.19,18.64 30.69,18.64 v31.24,18.09
NRF_RDYN  (via drill 0.2)
  Top 0.152: U2.16 21.79,10.19 20.24,10.19 18.29,12.14 18.29,14.49 18.89,15.09 18.89,15.64 18.39,16.14 v18.09,16.14 | U1.32 19.29,17.74 19.59,17.44 v19.89,17.44
  Bottom 0.152: v19.89,17.44 19.34,17.44 18.09,16.19 v18.09,16.14
NRF_REQN
  Top 0.152: U2.12 21.89,12.09 20.44,12.09 20.24,12.29 20.24,13.39 19.94,13.69 19.94,14.34 20.29,14.69 20.29,16.24 18.79,17.74 U1.31
NRF_RESETN  (via drill 0.2)
  Top 0.152: U2.19 23.69,9.19 23.69,8.99 23.49,8.79 21.14,8.79 17.94,11.99 17.94,14.94 v18.34,15.39 | U1.33 20.44,18.89 20.59,18.74 20.59,16.49 20.84,16.24 v20.84,15.79
  Bottom 0.152: v20.84,15.79 18.74,15.79 v18.34,15.39
PWR_HIGH
  Top 0.152: U1.54 16.79,27.79 16.74,27.84 16.74,31.14 17.24,31.64 U12.1
PWR_MODE  (via drill 0.2)
  Top 0.152: U12.3 23.34,30.94 v23.39,30.89 | U1.53 17.29,27.84 17.09,28.04 17.09,30.84 17.54,31.29 21.19,31.29 v21.44,31.04
  Bottom 0.152: v23.39,30.89 23.24,31.04 v21.44,31.04
US0_CLK  (via drill 0.2)
  Top 0.152: U1.42 20.64,23.39 20.89,23.64 21.89,23.64 v21.99,23.54 | v23.74,24.99 23.94,24.79 25.79,24.79 26.29,24.29 26.79,24.29 27.19,23.89 27.19,23.39 27.24,23.34 U3.4
  Bottom 0.152: v21.99,23.54 23.44,24.99 v23.74,24.99
US0_MISO
  Top 0.152: U1.43 20.59,23.89 20.79,24.09 25.44,24.09 25.64,23.89 25.64,22.34 26.19,21.79 U3.7
US0_MOSI
  Top 0.152: U1.44 20.54,24.39 20.59,24.44 25.64,24.44 25.99,24.09 25.99,22.49 26.19,22.29 U3.6
US1_CLK  (via drill 0.2, 0.2 pad 0.2)
  Top 0.152: U2.11 21.29,12.64 v20.79,13.14 | U1.30 18.29,17.74 19.94,16.09 19.94,14.79 19.54,14.39 19.54,13.29 v19.69,13.14
  Bottom 0.152: v20.79,13.14 v19.69,13.14
US1_MISO
  Top 0.152: U2.14 21.79,11.09 19.79,11.09 19.44,11.44 19.44,12.59 19.14,12.89 19.14,14.44 19.59,14.89 19.59,15.94 17.79,17.74 U1.29
US1_MOSI  (via drill 0.2)
  Top 0.152: v19.99,11.69 20.09,11.59 21.69,11.59 U2.13 | U1.28 17.29,17.74 19.24,15.79 19.24,14.99 18.74,14.49 18.74,12.49 v18.89,12.34
  Bottom 0.152: v18.89,12.34 19.34,12.34 v19.99,11.69
USB_DM
  Top 0.152: U1.47 R27.2
USB_DP
  Top 0.152: U1.48 20.78,26.39 R28.2
USB_VBUS  (via drill 0.2)
  Top 0.152: 32.14,23.89 C5.1 31.64,23.84 | 32.14,23.89 32.19,23.94 32.14,23.99 32.14,23.89 | 31.99,28.04 U14.1 | C15.1 17.94,28.74 21.54,28.74 21.59,28.79 22.34,28.79 v22.84,28.29 23.09,28.04 24.79,28.04 25.39,28.64 28.89,28.64 29.49,29.24 31.24,29.24 D10.C | v22.84,25.34 22.29,24.79 20.64,24.79 20.54,24.89 U1.45 | U14.5 31.24,25.94 31.39,25.79 32.84,25.79
  Top 0.254: 32.14,23.89 U7.1 | U7.2 31.64,23.84
  Top 0.305: C15.1 U1.52
  Top 0.406: 32.14,24.04 C5.1 32.29,23.89 32.84,24.44 32.84,25.79 32.84,27.59 32.34,28.09 U14.1 31.89,28.64 D10.C
  Bottom 0.152: v22.84,28.29 v22.84,25.34
VBATT  (via drill 0.2)
  Top 0.406: BAT1.1 B+.1 | R2.2 28.59,25.59 v29.89,25.59
  Bottom 0.152: B1.+ 32.51,13.91
  Bottom 0.406: 32.51,13.91 33.59,14.99 33.59,21.29 32.74,22.14 32.74,25.59 | v29.89,25.59 32.74,25.59 | 32.74,25.59 33.64,25.59 33.99,25.94 B+.1
VCC  (via drill 0.2, 0.2 pad 0.2)
  Top 0.152: 29.8,21.27 C1.1 29.94,21.29 U3.14 | U9.3 10.05,15.5 10.05,15.44 | U8.3 29.94,17.34 | U3.1 28.74,23.34 28.94,23.54 28.94,23.78 | 28.94,23.78 28.94,23.79 C23.1 28.94,23.78 | 28.09,34.69 C3.1 | R15.1 21.84,28.19 v21.89,28.24 | 24.79,23.24 R25.2
  Top 0.2: v29.59,23.34 29.14,23.79 28.94,23.79 | 10.05,15.44 9.64,15.44 9.34,15.14 R5.2 C10.1 8.74,15.34 v8.89,15.49 | U9.2 U9.3 | 29.94,17.34 29.94,17.29 29.44,17.29 v29.29,17.14 29.24,17.09 R7.2 | U8.3 U8.2 30.65,17.35 30.69,17.39 30.54,17.54 C11.1
  Top 0.254: v29.69,20.64 29.84,20.79 C1.1 | U13.7 28.09,34.69 | C3.1 28.19,35.29 v28.14,35.34 28.04,35.44 R14.1
  Top 0.406: v23.74,23.24 24.79,23.24 | D1.A v15.04,34.09 D2.A | D3.A v10.04,31.79 D4.A | v7.94,29.94 D5.A D6.A | D7.A v3.94,23.09 D8.A
  Top 0.61: JPDEBUG.1 35.69,18.94 v36.29,19.54
  pour Route15: 37.39,18.99 37.39,36.99 arc90 36.99,37.39 18.99,37.39 arc133 5.49,6.49 32.49,6.49 arc43
VUNREG  (via drill 0.2)
  Top 0.152: 31.89,27.14 U14.C | 30.59,27.19 U14.D | 21.44,33.54 C18.1
  Top 0.2: 18.56,35.11 v18.54,35.14
  Top 0.254: U11.4 28.59,29.79 28.89,30.09 28.89,30.79 28.59,31.09 U11.6 28.29,31.14 28.29,31.73 C20.1 v28.29,32.54 | 22.29,33.54 22.34,33.64 U12.8
  Top 0.406: U14.6 31.89,27.14 | U14.C U14.D | 30.59,27.19 U14.3 30.57,28.1 30.57,28.4 30.29,28.69 v29.94,28.69 | C18.1 22.29,33.54 | v3.64,17.64 3.59,17.74 3.59,18.49 3.56,18.51 D9.1 | D0.1 18.56,35.11
  Top 0.61: v21.49,34.44 C18.1
  Bottom 0.406: v21.49,34.44 21.49,31.74 | 21.49,31.74 28.29,31.74 | 18.54,31.74 15.54,31.74 8.34,24.54 8.34,23.54 6.69,21.89 4.69,21.89 3.64,20.84 v3.64,17.64 | v18.54,35.14 18.54,31.74 | 28.29,31.74 28.29,30.34 v29.94,28.69 | 28.29,31.74 v28.29,32.54 | 18.54,31.74 21.49,31.74

## Text on the board
tDocu: U1
tSilk: + | - | Firefly Design | Mint v1.0
bSilk: + | -